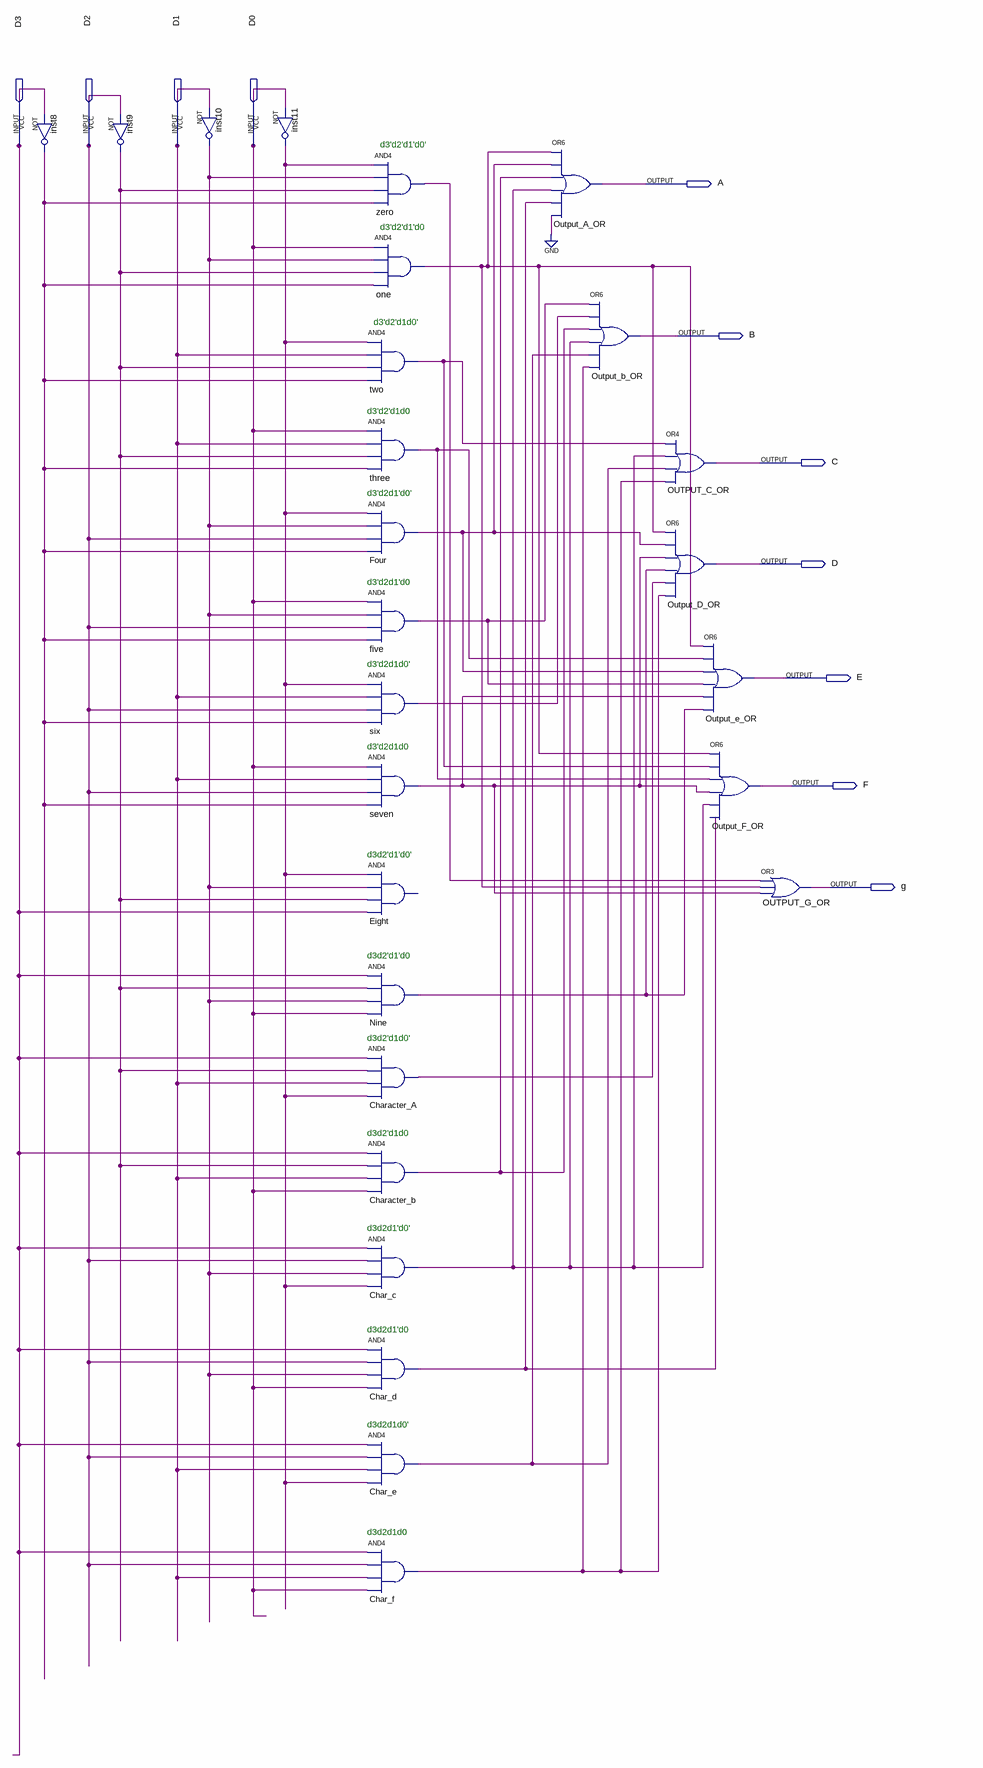
[diagram p0: schematic sheet]
// Quartus schematic Lab11.bdf as structural Verilog: 27 symbols, 11 pins
module Lab11 (
  input  D3,
  input  D2,
  input  D1,
  input  D0,
  output A,
  output B,
  output C,
  output D,
  output E,
  output F,
  output g
);

  wire Char_c_out, Char_d_out, Char_e_out, Char_f_out, Character_A_out, Character_b_out, five_out, Four_out,
       inst8_out, inst9_out, inst10_out, inst11_out, Nine_out, one_out, seven_out, six_out, three_out,
       two_out, zero_out;

  not inst8 (inst8_out, D3);
  not inst9 (inst9_out, D2);
  not inst10 (inst10_out, D1);
  not inst11 (inst11_out, D0);
  and zero (zero_out, inst11_out, inst10_out, inst9_out, inst8_out);
  and one (one_out, D0, inst10_out, inst9_out, inst8_out);
  and two (two_out, inst11_out, D1, inst9_out, inst8_out);
  and three (three_out, D0, D1, inst9_out, inst8_out);
  and Four (Four_out, inst11_out, inst10_out, D2, inst8_out);
  and five (five_out, D0, inst10_out, D2, inst8_out);
  and six (six_out, inst11_out, D1, D2, inst8_out);
  and seven (seven_out, D0, D1, D2, inst8_out);
  // AND4 Eight has open pins: IN1=inst11_out, IN2=inst10_out, IN3=inst9_out, IN4=D3, OUT=open
  and Nine (Nine_out, D3, inst9_out, inst10_out, D0);
  and Character_A (Character_A_out, D3, inst9_out, D1, inst11_out);
  and Character_b (Character_b_out, D3, inst9_out, D1, D0);
  and Char_c (Char_c_out, D3, D2, inst10_out, inst11_out);
  and Char_d (Char_d_out, D3, D2, inst10_out, D0);
  and Char_e (Char_e_out, D3, D2, D1, inst11_out);
  and Char_f (Char_f_out, D3, D2, D1, D0);
  or Output_A_OR (A, one_out, Four_out, Character_b_out, Char_c_out, Char_d_out, 1'b0);
  or Output_b_OR (B, five_out, six_out, Character_b_out, Char_c_out, Char_e_out, Char_f_out);
  or OUTPUT_C_OR (C, two_out, Char_c_out, Char_e_out, Char_f_out);
  or Output_D_OR (D, one_out, Four_out, seven_out, Nine_out, Character_A_out, Char_f_out);
  or Output_e_OR (E, one_out, three_out, Four_out, five_out, seven_out, Nine_out);
  or Output_F_OR (F, one_out, two_out, three_out, seven_out, Char_c_out, Char_d_out);
  or OUTPUT_G_OR (g, zero_out, one_out, seven_out);

  // Notes on the sheet:
  //   d3'd2'd1'd0'
  //   d3'd2'd1'd0
  //   d3'd2'd1d0'
  //   d3'd2'd1d0
  //   d3'd2d1'd0'
  //   d3'd2d1'd0
  //   d3'd2d1d0'
  //   d3'd2d1d0
  //   d3d2'd1'd0'
  //   d3d2'd1'd0
  //   d3d2'd1d0'
  //   d3d2'd1d0
  //   d3d2d1'd0'
  //   d3d2d1'd0
  //   d3d2d1d0'
  //   d3d2d1d0
endmodule
